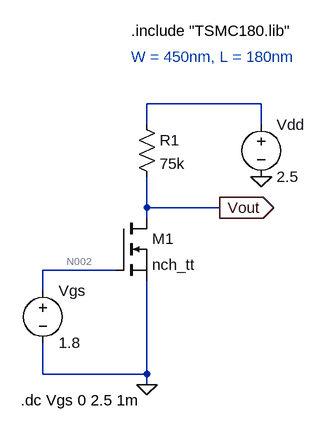
[diagram p0: schematic Q5.asc]
Q5.asc, the LTspice schematic file:
Version 4
SHEET 1 1148 680
WIRE 480 32 304 32
WIRE 304 64 304 32
WIRE 480 64 480 32
WIRE 304 192 304 144
WIRE 416 192 304 192
WIRE 304 208 304 192
WIRE 256 288 144 288
WIRE 144 320 144 288
WIRE 144 448 144 400
WIRE 304 448 304 304
WIRE 304 448 144 448
WIRE 304 464 304 448
FLAG 304 464 0
FLAG 480 144 0
FLAG 416 192 Vout
IOPIN 416 192 Out
SYMBOL nmos 256 208 R0
SYMATTR InstName M1
SYMATTR Value nch_tt
SYMATTR Value2 W=450n L=180n
SYMBOL voltage 144 304 R0
WINDOW 123 0 0 Left 0
WINDOW 39 0 0 Left 0
SYMATTR InstName Vgs
SYMATTR Value 1.8
SYMBOL res 288 48 R0
SYMATTR InstName R1
SYMATTR Value 75k
SYMBOL voltage 480 48 R0
WINDOW 123 0 0 Left 0
WINDOW 39 0 0 Left 0
SYMATTR InstName Vdd
SYMATTR Value 2.5
TEXT 280 -80 Left 2 !.include "TSMC180.lib"
TEXT 280 -40 Left 2 ;W = 450nm, L = 180nm
TEXT 110 488 Left 2 !.dc Vgs 0 2.5 1m

The netlist it stands for:
* Q5.asc
M1 Vout N002 0 0 nch_tt W=450n L=180n
Vgs N002 0 1.8
R1 N001 Vout 75k
Vdd N001 0 2.5
.model NMOS NMOS
.model PMOS PMOS
.lib standard.mos
.include "TSMC180.lib"
* W = 450nm, L = 180nm
.dc Vgs 0 2.5 1m
.backanno
.end

* Results of the author's LTspice run, read from the files saved beside the schematic
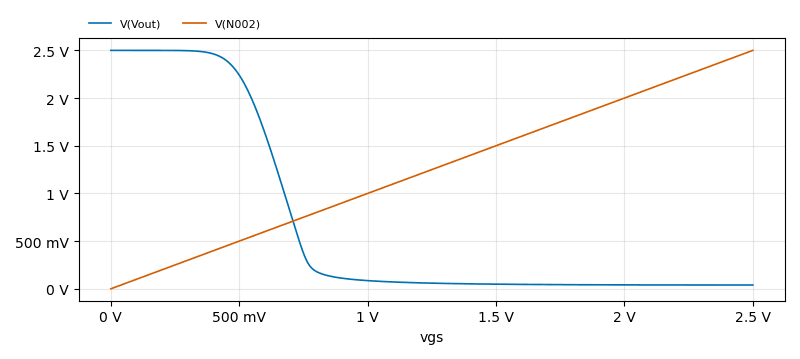
[diagram p1: DC transfer characteristic of Q5.asc, plotted from the saved traces]
* DC transfer characteristic, 1 run:
*   V(Vout): 2.5 V at vgs=0 V, 39.72 mV at vgs=2.5 V, min 39.7 mV, max 2.5 V
*   V(N002): 0 V at vgs=0 V, 2.5 V at vgs=2.5 V, min 0 V, max 2.5 V